# EAGLE design To-mate-Oh (EAGLE 6.5.0)
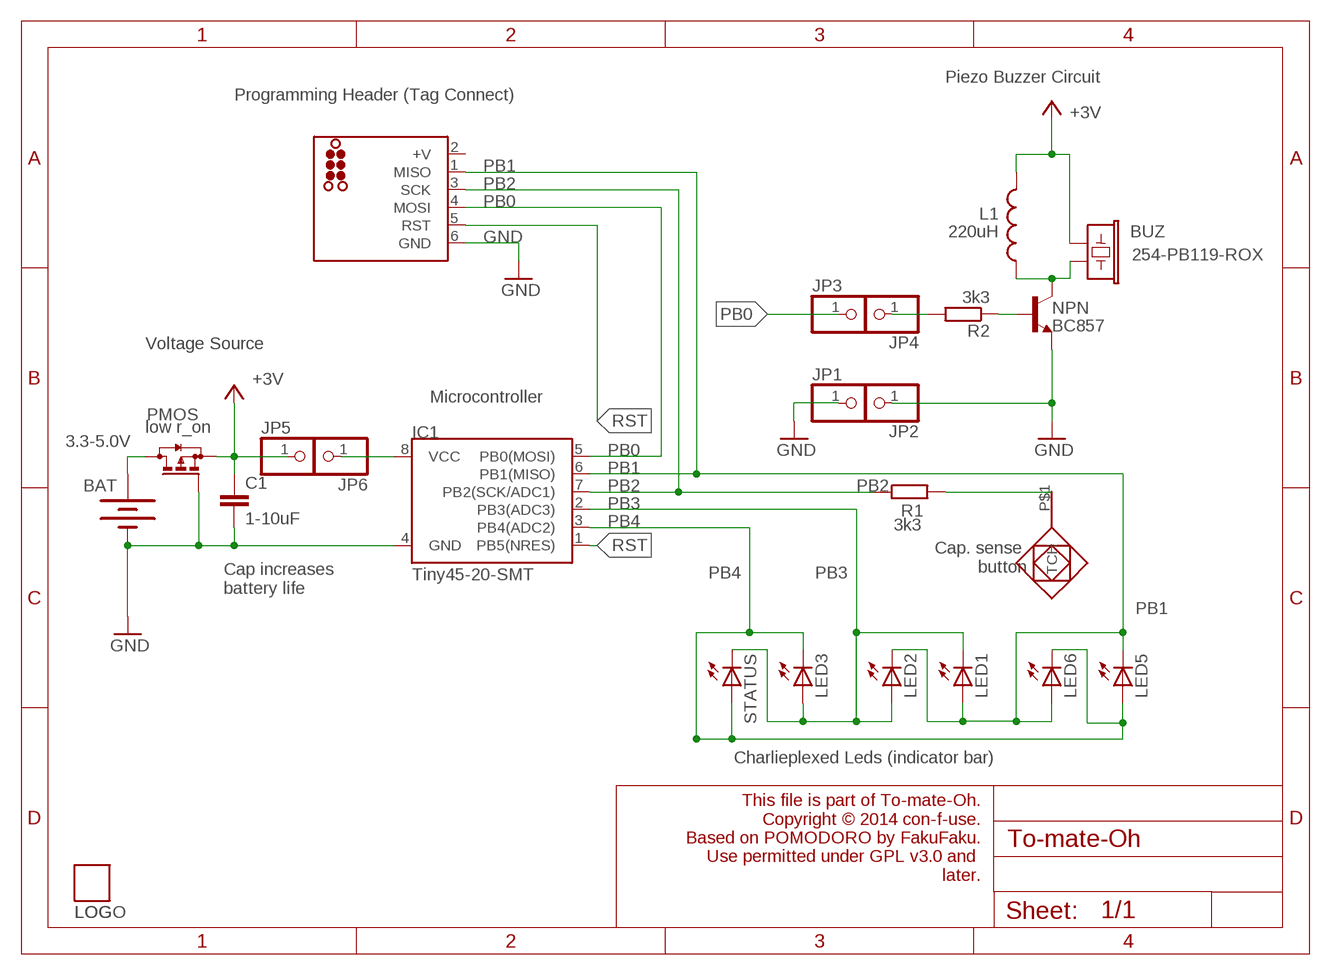
[diagram p0: schematic, sheet 1]

## Parts
BAT  3.3-5.0V  BATTERYFOB  [BATTERY_20MM_PTH_COMPACT]
BUZ  254-PB119-ROX  BUZZERSMD3  [BUZZER-CMT1102]
C1  1-10uF  C-EUC1210  [C1210]
CAP_SENSE  PAD  [EMPTY]
IC1  Tiny45-20-SMT  ATTINY45TINY45-20-SMT  [SO08-EIAJ]
ISP  ATMEL-ISPATMEL_ISP_TC2030  [TC2030-MCP-NL]
JP1  JGND1  PINHD-1X1  [1X01]
JP2  JGND2  PINHD-1X1  [1X01]
JP3  JPB1  PINHD-1X1  [1X01]
JP4  JPB2  PINHD-1X1  [1X01]
JP5  JVCC1  PINHD-1X1  [1X01]
JP6  JVCC2  PINHD-1X1  [1X01]
L1  220uH  INDUCTOR1007  [1007]
LED1  Blue  LEDCHIPLED_0805  [CHIPLED_0805]
LED2  Blue  LEDCHIPLED_0805  [CHIPLED_0805]
LED3  Blue  LEDCHIPLED_0805  [CHIPLED_0805]
LED5  Blue  LEDCHIPLED_0805  [CHIPLED_0805]
LED6  Blue  LEDCHIPLED_0805  [CHIPLED_0805]
LOG  UNETHILOGO  [UNETHILOGO_TINY_SILK]
LOGO  UNETHILOGOUNETHILOGO_TINY  [UNETHILOGO_TINY]
NPN  BC857  BC849-NPN-SOT23-BEC  [SOT23-BEC]
PMOS  low r_on  BSS84  [SOT23]
R1  3k3  R-EU_R0805  [R0805]
R2  3k3  R-EU_R0805  [R0805]
STATUS  Red  LEDCHIPLED_0805  [CHIPLED_0805]

## Nets
BAT+: BAT.1(+) BAT.1@2(+) PMOS.3(D)
BTN: CAP_SENSE.P$1(TCH) R1.2
GND: BAT.2(-) C1.2 IC1.4(GND) ISP.6(GND) JP1.1 JP2.1 NPN.E PMOS.1(G)
N$1: JP4.1 R2.2
N$5: NPN.B R2.1
N$6: IC1.8(VCC) JP6.1
N$7: BUZ.2 L1.1 NPN.C
PB0: IC1.5(PB0(MOSI)) ISP.4(MOSI) JP3.1
PB1: IC1.6(PB1(MISO)) ISP.1(MISO) LED1.A LED2.C LED5.C LED6.A
PB2: IC1.7(PB2(SCK/ADC1)) ISP.3(SCK) R1.1
PB3: IC1.2(PB3(ADC3)) LED1.C LED2.A LED3.A STATUS.C
PB4: IC1.3(PB4(ADC2)) LED3.C LED5.A LED6.C STATUS.A
RST: IC1.1(PB5(NRES)) ISP.5(RST)
VCC: BUZ.1 C1.1 JP5.1 L1.2 PMOS.2(S) ; supply symbol labelled +3V

## Notes on the sheet
- Piezo Buzzer Circuit
- Programming Header (Tag Connect)
- Voltage Source
- Microcontroller
- Cap. sense 
  button
- Cap increases 
  battery life
- Charlieplexed Leds (indicator bar)
- This file is part of To-mate-Oh.
  Copyright © 2014 con-f-use.
  Based on POMODORO by FakuFaku.
  Use permitted under GPL v3.0 and 
  later.

## Power pins joined to a net without a drawn wire
+V: ISP.2(+V)

## Library data of the parts
BAT = jcgb:BATTERY: Battery Holders Various common sizes : AA, AAA, 20mm coin cell and 12mm coin cell. 20MM_4LEGS, BATT-10373
BUZ = SparkFun-Electromechanical:BUZZER: Buzzer 12mm Spark Fun Electronics SKU : Comp-Buzzer
C1 = rcl:C-EU: CAPACITOR, European symbol
CAP_SENSE = jcgb:PAD
IC1 = SparkFun-DigitalIC:ATTINY45: Atmel 8-pin 2/4/8kB flash uC; PROD_ID: IC-08922
ISP = jcgb:ATMEL-ISP
JP1-JP6 = pinhead:PINHD-1X1: PIN HEADER
L1 = SparkFun:INDUCTOR: Inductors Basic Inductor/Choke - 0603 and 1206. Footprints are not proven and vary greatly between part numbers.
LED1-LED3 LED5 LED6 STATUS = led:LED: LED OSRAM: - CHIPLED LG R971, LG N971, LY N971, LG Q971, LY Q971, LO R971, LY R971 LH N974, LH R974 LS Q976, LO Q976, LY Q976 LO Q996 - Hyper CHIPLED LW Q18S LB Q993, LB Q99A, LB R99A - SideLED LS A670, LO A670, LY A670, LG A670, LP A670 LB A673, LV A673, LT A673, LW A673 LH A674 LY A675 LS A676, LA A676, LO A676, LY A676, LW A676 LS A679, LY A679, LG A679 - Hyper Micro SIDELED® LS Y876, LA Y876, LO Y876, LY Y876 LT Y87S - SmartLED LW L88C, LW L88S LB L89C, LB L89S, LG L890 LS L89K, LO L89K, LY L89K LS L896, LA L896, LO L896, LY L896 - TOPLED LS T670, LO T670, LY T670, LG T670, LP T670 LSG T670, LSP T670, LSY T670, LOP T670, LYG T670 LG T671, LOG T671, LSG T671 LB T673, LV T673, LT T673, LW T673 LH T674 LS T676, LA T676, LO T676, LY T676, LB T676, LH T676, LSB T676, LW T676 LB T67C, LV T67C, LT T67C, LS T67K, LO T67K, LY T67K, LW E67C LS E67B, LA E67B, LO E67B, LY E67B, LB E67C, LV E67C, LT E67C LW T67C LS T679, LY T679, LG T679 LS T770, LO T770, LY T770, LG T770, LP T770 LB T773, LV T773, LT T773, LW T773 LH T774 LS E675, LA E675, LY E675, LS T675 LS T776, LA T776, LO T776, LY T776, LB T776 LHGB T686 LT T68C, LB T68C - Hyper Mini TOPLED® LB M676 - Mini TOPLED Santana® LG M470 LS M47K, LO M47K, LY M47K Source: http://www.osram.convergy.de LUXEON: - LUMILED® LXK2-PW12-R00, LXK2-PW12-S00, LXK2-PW14-U00, LXK2-PW14-V00 LXK2-PM12-R00, LXK2-PM12-S00, LXK2-PM14-U00 LXK2-PE12-Q00, LXK2-PE12-R00, LXK2-PE12-S00, LXK2-PE14-T00, LXK2-PE14-U00 LXK2-PB12-K00, LXK2-PB12-L00, LXK2-PB12-M00, LXK2-PB14-N00, LXK2-PB14-P00, LXK2-PB14-Q00 LXK2-PR12-L00, LXK2-PR12-M00, LXK2-PR14-Q00, LXK2-PR14-R00 LXK2-PD12-Q00, LXK2-PD12-R00, LXK2-PD12-S00 LXK2-PH12-R00, LXK2-PH12-S00 LXK2-PL12-P00, LXK2-PL12-Q00, LXK2-PL12-R00 Source: www.luxeon.com KINGBRIGHT: KA-3528ASYC Source: www.kingbright.com
LOG LOGO = jcgb:UNETHILOGO: UNETHI_LOGO
NPN = transistor:*-NPN-: NPN Transistror BF959 corrected 2008.03.06
PMOS = transistor-small-signal:BSS84: P-CHANNEL MOS FET
R1 R2 = rcl:R-EU_: RESISTOR, European symbol

## Board
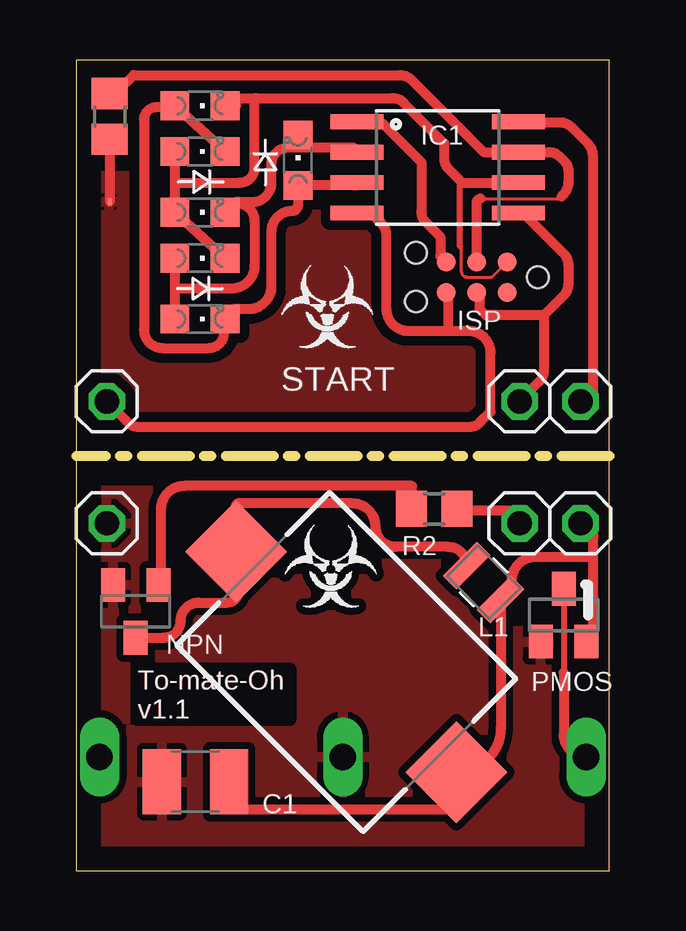
[diagram p1: board, top side]
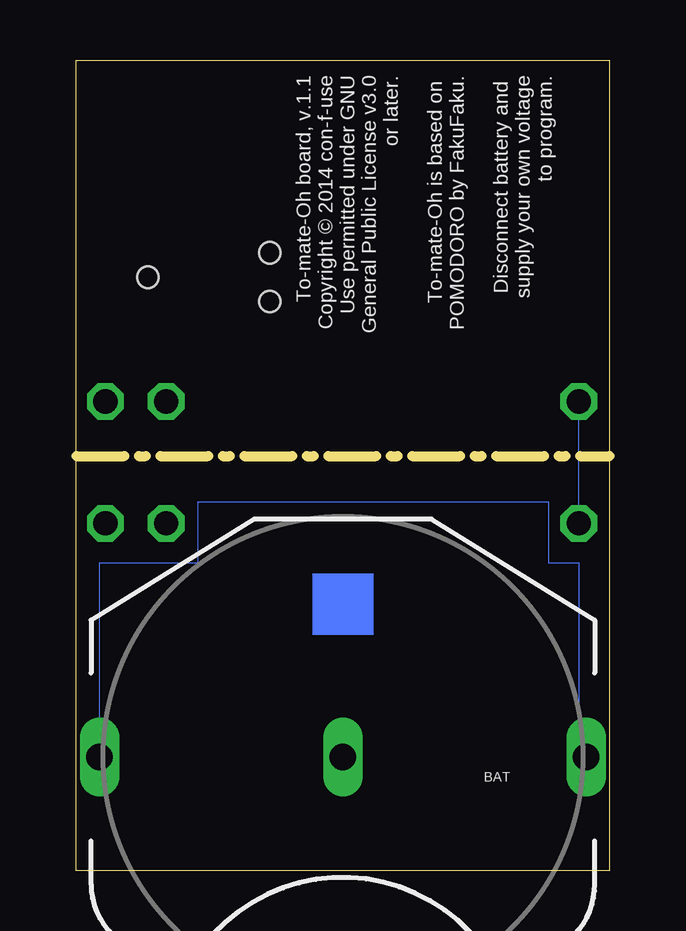
[diagram p2: board, bottom side, seen from below]

Size 22.23 x 33.78 mm. Coordinates in mm from the lower left corner, seen from the top.
Outline: 22.23,17.27 0,17.27
Outline: 0,33.78 0,0 22.22,0 22.22,33.78 0,33.78
Copper layers (1*16): Top 0.035mm / dielectric 1.5mm / Bottom 0.035mm
Design rules "default": minimum track width 10mil, minimum drill 24mil, track to track 8mil, track to pad 8mil, pad to pad 8mil, via to via 8mil, smd to smd 8mil, copper to edge 40mil, drill to drill 8mil, minimum pad ring 10mil, minimum via ring 8mil, stop-mask expansion 4mil, vias tented up to drill 0mil, thermal gap 10mil
Milling: 13 lines

### Footprints (pad centres in the part's own frame; a part is rotated, then mirrored left to right if it is on the bottom)
BATTERY_20MM_PTH_COMPACT = drill 1.1 long: 1 -10.144,0; 1@2 10.144,0; 2 0,0
BUZZER-CMT1102 = smd 3 x 3: 1 -6.5,0; 2 6.5,0
C1210 = smd 1.6 x 2.7: 1 -1.4,0; 2 1.4,0
EMPTY = smd 0.305 x 0.152: P$1 0,0
SO08-EIAJ = smd 0.61 x 2.21: 1 -1.905,-3.378; 2 -0.635,-3.378; 3 0.635,-3.378; 4 1.905,-3.378; 5 1.905,3.353; 6 0.635,3.353; 7 -0.635,3.353; 8 -1.905,3.353
TC2030-MCP-NL = smd 0.787 x 0.787: 1 1.27,-0.635; 2 1.27,0.635; 3 2.54,-0.635; 4 2.54,0.635; 5 3.81,-0.635; 6 3.81,0.635 | hole 0.889: 0,0; 5.08,-1.016; 5.08,1.016
1X01 = drill 1.016 octagon: 1 0,0
1007 = smd 2 x 0.8: 1 0,1; 2 0,-1
CHIPLED_0805 = smd 1.2 x 1.2: A 0,-1.05; C 0,1.05
SOT23-BEC = smd 1 x 1.4: B -0.95,-1.1; C 0,1.1; E 0.95,-1.1
SOT23 = smd 1 x 1.4: 1 -0.95,-1.1; 2 0.95,-1.1; 3 0,1.1
R0805 = smd 1.3 x 1.5: 1 -0.95,0; 2 0.95,0

### Placement (x,y rotation side)
BAT  11.11,4.74 180 bottom
BUZ  11.26,8.69 135 top
C1  4.97,3.71 180 top
CAP_SENSE  1.4,27.87 90 top
IC1  15.08,29.3 270 top
ISP  19.24,24.73 180 top
JP1  1.27,19.55 270 top
JP2  1.27,14.47 270 top
JP3  18.48,19.55 270 top
JP4  18.48,14.47 270 top
JP5  21.02,14.47 270 top
JP6  21.02,19.55 270 top
L1  16.99,12.01 45 top
LED1  5.16,27.43 270 top
LED2  5.16,25.52 270 top
LED3  5.16,22.98 270 top
LED5  5.16,31.87 270 top
LED6  5.16,29.97 270 top
LOG  8.48,21.73 0 top
LOGO  8.62,10.92 0 top
NPN  2.48,10.8 180 top
PMOS  20.32,10.65 0 top
R1  1.4,31.43 270 top
R2  14.92,15.07 0 top
STATUS  9.24,29.6 0 top

### Tracks (layer width: path | path; a pad name or v marks a point on that pad's centre or on a via)
BAT+
  Top 0.254: PMOS.3 20.32,8.25
  Top 0.406: 20.32,8.25 20.32,5.68 arc90 BAT.1@2
  Bottom 0: BAT.1@2 21.26,12.82 17.14,12.82 17.14,15.36 2.54,15.36 2.54,12.82 1.27,12.82 1.27,5.74 BAT.1
BTN
  Top 0.406: R1.2 CAP_SENSE.P$1
  pour Top (isolate 0.406): 17.27,18.6 16.51,18.54 0.17,18.17 0.29,28.98 8.1,28.95 10.1,29.13 13.34,29.14 17.14,29.14 17.18,23.25
GND
  Top 0.406: IC1.4 12.54,27.39 12.54,27.14 12.74,26.95 arc-45 12.92,26.5 12.92,23.43 arc90 13.86,22.49 15.49,22.49 | ISP.6 15.53,24 arc90 15.49,23.97 15.49,22.49 | JP1.1 2.15,18.67 arc45 2.6,18.49 16.39,18.49 arc45 16.84,18.67 17.27,19.11 17.27,21.58 arc90 16.36,22.49 15.49,22.49
  Bottom 0: JP2.1 JP1.1
  pour Top (isolate 0.305): 15,17 15,11.99 16.81,10.18 arc45 17.26,9.99 20,9.99 21.81,8.18 arc-45 22,7.73 22,-0.01 0,-0.01 0,17
N$1
  Top 0.406: JP4.1 18.48,14.52 arc90 18,14.99 15.95,14.99 arc-90 R2.2
N$5
  Top 0.406: R2.1 13.97,15.46 14,15.49 14,16.03 4.51,16.03 arc90 3.52,15.04 3.52,12 NPN.B
N$6
  Top 0.406: IC1.8 arc45 18.51,31.17 20.18,31.17 arc-45 20.63,30.99 21.34,30.28 arc-45 21.53,29.83 21.53,19.74 21.52,19.74 arc-45 21.07,19.55 JP6.1
N$7
  Top 0.406: L1.1 arc90 15.51,13.49 13.34,13.49 arc-90 12.48,14.35 arc90 11.53,15.3 6.76,15.3 arc90 6.66,15.19 BUZ.2 7,12.95 7,12.49 arc90 6.76,12.25 6.76,11.65 arc-90 6.29,11.17 5.11,11.17 arc90 4.35,10.41 arc-90 3.65,9.71 NPN.C
PB0
  Top 0.406: 18.89,27.39 18.64,27.39 | 16.7,23.9 ISP.4 16.83,23.97 16.83,23.39 17.08,23.14 19.49,23.14 | IC1.5 18.64,27.39 | 18.64,27.39 20.32,25.71 arc-45 20.51,25.26 20.51,24.42 arc-45 20.32,23.97 19.49,23.14 | 19.49,23.14 19.49,20.83 arc-45 19.31,20.38 JP3.1
PB1
  Top 0.127: 17.91,25.36 ISP.1 17.36,24.75 arc-45 17.3,24.73 16.29,24.73 arc-90 16.07,24.95 16.07,25.85 arc45 16,26 | 16,26.76 16.07,26.7 16.03,26.7 arc-90 16,26.73
  Top 0.254: 16,26.76 16,28.57 16.1,28.67 | 16,26 16,26.73
  Top 0.406: LED2.C LED1.A LED6.A 4.11,28.69 arc90 4.13,28.67 6.83,28.67 arc90 7.43,29.27 7.43,32.13 arc-90 7.49,32.19 | LED5.C 6.21,31.86 | 6.61,31.47 LED5.C | LED5.C 6.67,31.87 6.67,32.19 7.49,32.19 | 7.49,32.19 13.2,32.19 arc-45 13.65,32 15.34,30.32 15.34,29.69 arc45 15.52,29.24 16.1,28.67 IC1.6
PB2
  Top 0.127: 16.86,28 20.08,28 arc45 20.17,28.04 20.32,28.19
  Top 0.406: 20.23,28.09 20.32,28.19 arc45 20.51,28.64 20.51,29.22 arc45 20.38,29.52 20.16,29.75 arc45 19.71,29.94 IC1.7 16.99,29.94 13.96,32.96 arc45 13.52,33.14 2.38,33.14 1.75,32.51 1.75,32.38 R1.1 | ISP.3 16.7,27.84 arc-90 16.86,28
PB3
  Top 0.406: LED2.A 4.11,24.06 | 4.11,24.06 LED3.A | STATUS.C 9.37,30.65 9.37,30.29 9.34,30.25 | 9.16,30.57 STATUS.C | IC1.2 arc90 11.51,30.13 9.27,30.13 | 9.27,30.13 arc-90 9.24,30.16 STATUS.C | 9.27,30.13 8.83,30.13 arc90 8.13,29.43 8.13,28.67 arc-90 7.3,27.84 6.62,27.84 arc90 LED1.C 6.06,27.43 arc-90 6,27.49 6.22,27.49 arc90 6.54,27.81 6.7,27.81 arc-90 7.43,27.08 7.43,25.2 arc-90 6.48,24.25 4.3,24.25 arc90 4.11,24.06
PB4
  Top 0.406: 11.7,28.55 IC1.3 arc-90 11.59,28.55 STATUS.A 9.24,27.73 arc-90 9,27.49 arc90 8.13,26.62 8.13,24.35 arc-90 7.18,23.39 6.62,23.39 arc90 LED3.C arc90 6.16,22.94 6.16,22.41 arc-90 5.52,21.78 3.59,21.78 arc-90 2.83,22.54 2.83,31.3 arc-90 3.33,31.81 4.11,31.81 | 4.11,31.81 4.16,31.81 LED6.C | 4.11,31.81 LED5.A
RST
  Top 0.406: ISP.5 15.18,25.62 15.18,26.41 14.57,27.02 arc-45 14.38,27.47 14.38,29.52 12.81,31.09 arc45 12.54,31.21 IC1.1
VCC
  Top 0.406: 21,14.46 JP5.1 arc-90 21.56,13.93 21.56,13.27 | 21.56,13.27 arc-90 21.37,13.08 19.14,13.08 arc90 18.16,12.09 18.16,11.77 arc-90 L1.2 17.69,5.94 arc-90 BUZ.1 15.85,2.64 arc-90 15.78,2.57 6.13,2.57 6.13,3.47 arc-90 C1.1 | PMOS.2 arc-45 21.43,9.93 21.56,10.06 21.56,13.27

### Text on the board
Top: To-mate-Oh / v1.1
tPlace: START | To-mate-Oh / v1.1
bNames: To-mate-Oh board, v.1.1 / Copyright © 2014 con-f-use / Use permitted under GNU / General Public License v3.0 / or later. / / To-mate-Oh is based on / POMODORO by FakuFaku. / / Disconnect battery and / supply your own voltage / to program.
tDocu: This file is part of To-mate-Oh. / Copyright © 2014 con-f-use. / Based on POMODORO by FakuFaku. / Use permitted under GPL v3.0 and later.